# Altium project Projeto01_esp32_placa_desenvolvimento.PrjPcb
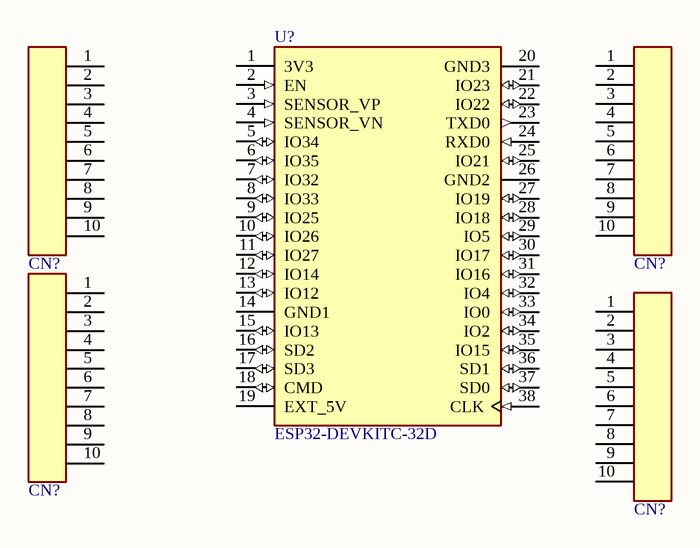
[diagram p0: esquematico.SchDoc]
1 sheet, 5 parts. Net scope: global (net labels, ports and power ports of the same name join across sheets).
Board file: layout.PcbDoc

## Sheet esquematico.SchDoc
size A4

### Parts
(Parts that share a designator on the sheet are numbered #1, #2 ... from top to bottom, then left to right.)
CN?#1  M20-7821042  [CON_HDR_10PIN_F]  (value not drawn)
CN?#2  M20-7821042  [CON_HDR_10PIN_F]  (value not drawn)
CN?#3  M20-7821042  [CON_HDR_10PIN_F]  (value not drawn)
CN?#4  M20-7821042  [CON_HDR_10PIN_F]  (value not drawn)
U?  ESP32-DEVKITC-32D  [ESP32DEVKITV4]

### Nets

Not connected (* = marked no-connect by the designer): CN?#1 1 2 3 4 5 6 7 8 9 10; CN?#2 1 2 3 4 5 6 7 8 9 10; CN?#3 1 2 3 4 5 6 7 8 9 10; CN?#4 1 2 3 4 5 6 7 8 9 10; U? 1(3V3) 2(EN) 3(SENSOR_VP) 4(SENSOR_VN) 5(IO34) 6(IO35) 7(IO32) 8(IO33) 9(IO25) 10(IO26) 11(IO27) 12(IO14) 13(IO12) 14(GND1) 15(IO13) 16(SD2) 17(SD3) 18(CMD) 19(EXT_5V) 20(GND3) 21(IO23) 22(IO22) 23(TXD0) 24(RXD0) 25(IO21) 26(GND2) 27(IO19) 28(IO18) 29(IO5) 30(IO17) 31(IO16) 32(IO4) 33(IO0) 34(IO2) 35(IO15) 36(SD1) 37(SD0) 38(CLK)

### Library data of the parts
CN?#1-CN?#4 = CON_HDR_10PIN_SINGLE_F: Connector Header Through Hole 10 position 0.100" (2.54mm); Manufacturer: Harwin; Fabricante: Sullins Connector Solutions; Number of Contacts: 4; Gender: Female; Number of Positions: 10; Connector Type: Receptacle,Socket; MPN: M20-7821042; Footprint: HDR 10 pin PTH; Value: M20-7821042; ComponentLink1Description: LOJA; ComponentLink1URL: https://www.digikey.com/product-detail/en/harwin-inc/M20-7821042/952-1846-ND/3727813; ComponentLink2Description: DATASHEET; ComponentLink2URL: https://cdn.harwin.com/pdfs/C001XX_M20_Series_Connectors.pdf; Supplier 1: Mouser; Supplier Part Number 1: 855-M20-7821042; Manufacturer Part Number: M20-7821042; Stock 1: 4770; Pricing 1: 1=1,39000, 10=1,18000, 100=1,02000, 500=0,86300, 1000=0,76800, 2500=0,67100 (USD); RoHS: Yes; Mount: Through Hole; Case/Package: SIL; Contact Plating: Tin,Gold; Color: Black; Number of Rows: 1; Termination: Solder; Contact Gender: Female; Package Quantity: 23; Packaging: Rail/Tube; Pitch: 2.54mm; Radiation Hardening: No; ComponentLink3URL: https://datasheet.ciiva.com/9480/m20-782-9480090.pdf?src-supplier=Avnet; ComponentLink3Description: https://datasheet.ciiva.com/9480/m20-782-9480090.pdf?src-supplier=Avnet; ComponentLink4URL: https://datasheet.ciiva.com/6784/m20-782-6784540.pdf?src-supplier=Digi-Key; ComponentLink4Description: https://datasheet.ciiva.com/6784/m20-782-6784540.pdf?src-supplier=Digi-Key
U? = ESP32-DEVKITC-32D: EVAL BOARD FOR ESP-WROOM-32; MF: Espressif Systems; Value: *; MP: ESP32-DEVKITC-32D; Price: None; Check_prices: https://www.snapeda.com/parts/ESP32-DEVKITC-32D/Espressif%20Systems/view-part/2777395/?ref=eda; SnapEDA_Link: https://www.snapeda.com/parts/ESP32-DEVKITC-32D/Espressif%20Systems/view-part/2777395/?ref=snap; Availability: Warning; Purchase-URL: https://pricing.snapeda.com/search/part/ESP32-DEVKITC-32D/?ref=eda; Package: None